# EAGLE design pcb (EAGLE 7.7.0)
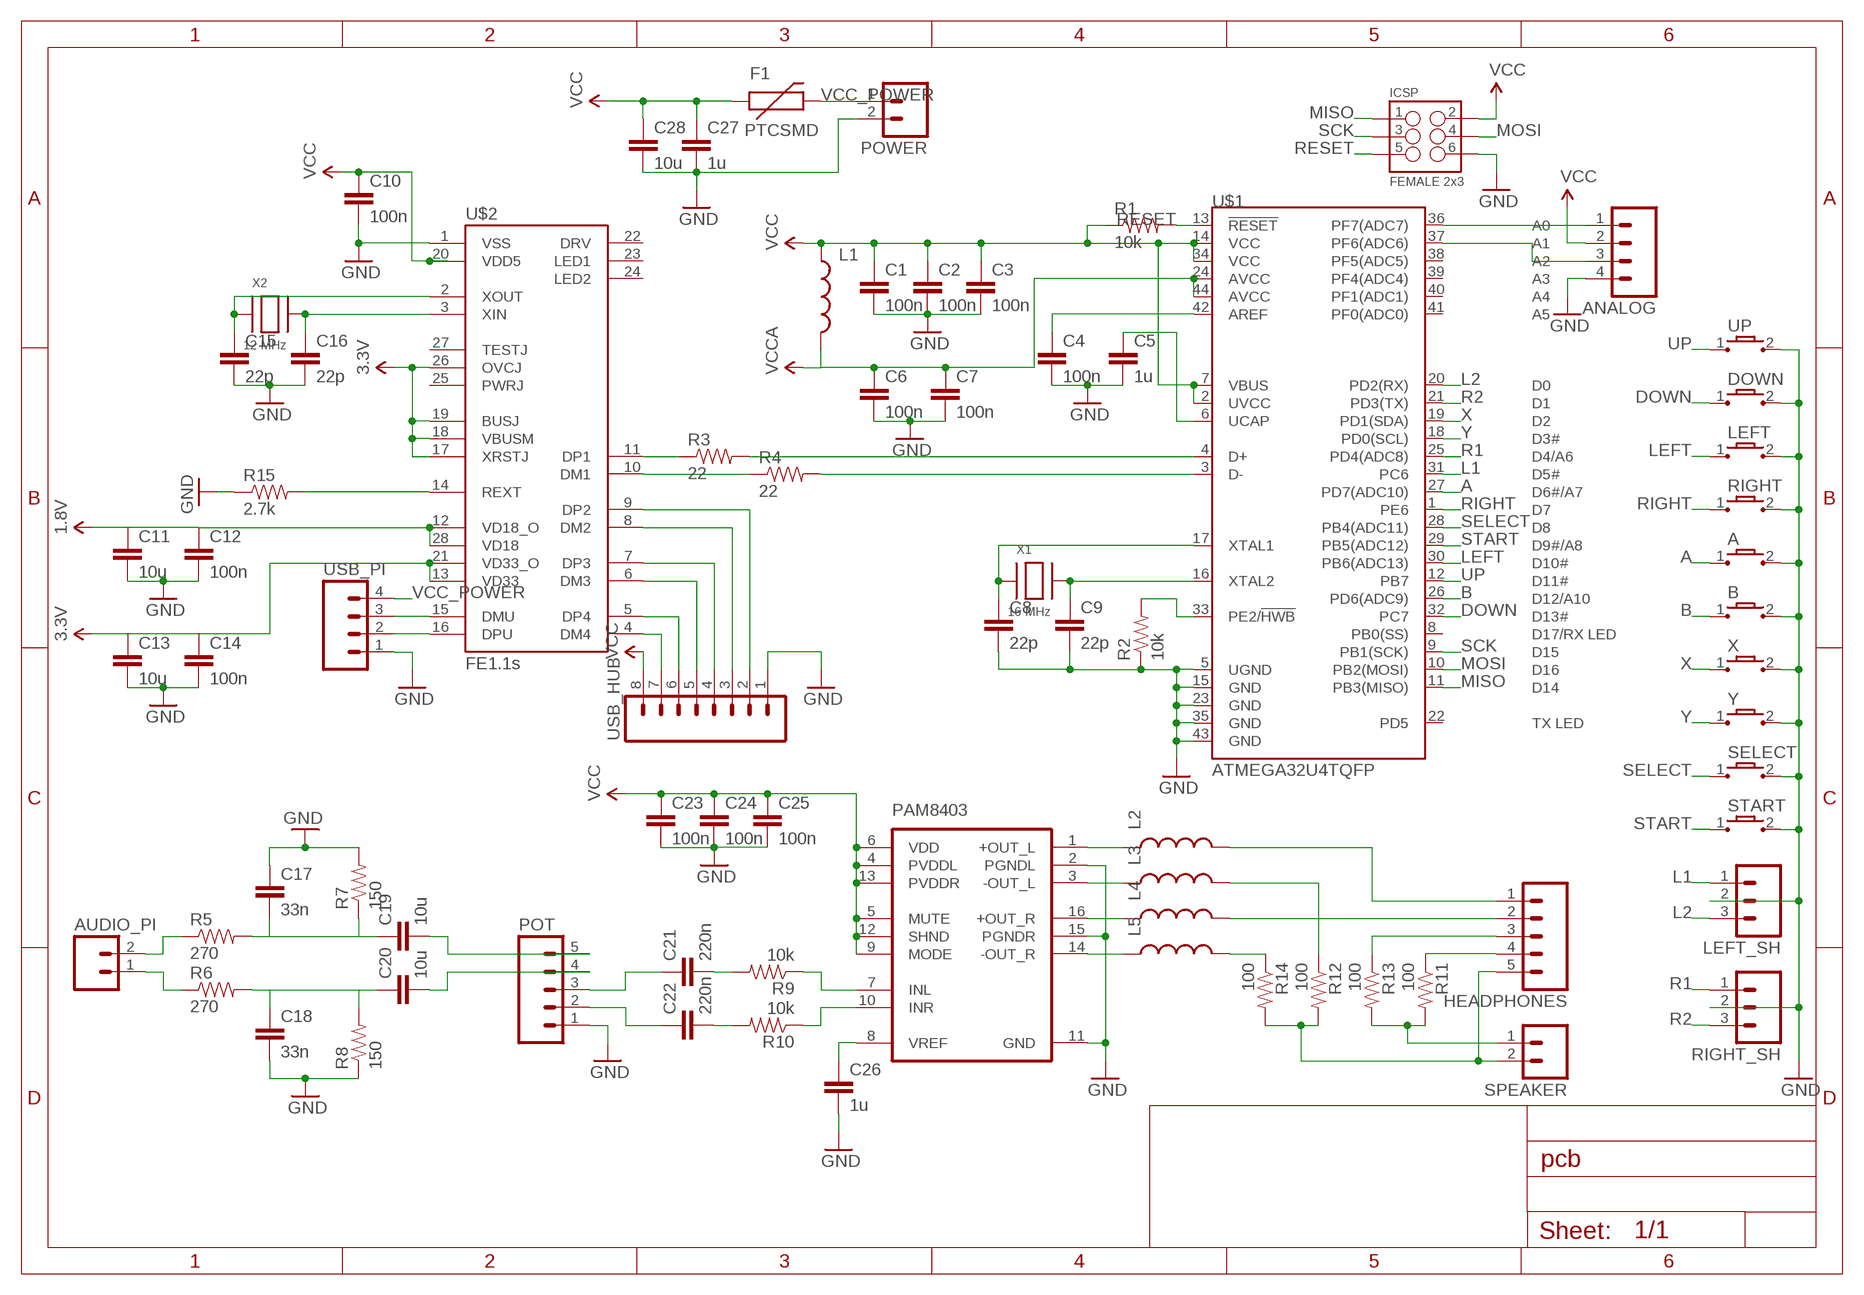
[diagram p0: schematic, sheet 1]

## Parts
A  DMG_CONDUCTIVE  [CIRCLE_BUTTON2]
ANALOG  M04PTH  [1X04]
AUDIO_PI  M02PTH  [1X02]
B  DMG_CONDUCTIVE  [CIRCLE_BUTTON2]
C1  100n  CAP0805  [0805]
C2  100n  CAP0805  [0805]
C3  100n  CAP0805  [0805]
C4  100n  CAP0805  [0805]
C5  1u  CAP0805  [0805]
C6  100n  CAP0805  [0805]
C7  100n  CAP0805  [0805]
C8  22p  CAP0805  [0805]
C9  22p  CAP0805  [0805]
C10  100n  CAP0805  [0805]
C11  10u  CAP0805  [0805]
C12  100n  CAP0805  [0805]
C13  10u  CAP0805  [0805]
C14  100n  CAP0805  [0805]
C15  22p  CAP0805  [0805]
C16  22p  CAP0805  [0805]
C17  33n  CAP0805  [0805]
C18  33n  CAP0805  [0805]
C19  10u  CAP0805  [0805]
C20  10u  CAP0805  [0805]
C21  220n  CAP0805  [0805]
C22  220n  CAP0805  [0805]
C23  100n  CAP0805  [0805]
C24  100n  CAP0805  [0805]
C25  100n  CAP0805  [0805]
C26  1u  CAP0805  [0805]
C27  1u  CAP0805  [0805]
C28  10u  CAP0805  [0805]
DOWN  DMG_CONDUCTIVE  [CIRCLE_BUTTON2]
F1  PTCSMD  [PTC-1206]
HEADPHONES  M05PTH  [1X05]
ICSP  FEMALE 2x3  M03X2FEMALE  [2X3]
L1  INDUCTOR0805  [0805]
L2  INDUCTOR0805  [0805]
L3  INDUCTOR0805  [0805]
L4  INDUCTOR0805  [0805]
L5  INDUCTOR0805  [0805]
LEFT  DMG_CONDUCTIVE  [CIRCLE_BUTTON2]
LEFT_SH  M03PTH  [1X03]
PAM8403  PAM8403  [SOP-16]
POT  M05PTH  [1X05]
POWER  M02PTH  [1X02]
R1  10k  RESISTOR0805-RES  [0805]
R2  10k  RESISTOR0805-RES  [0805]
R3  22  RESISTOR0805-RES  [0805]
R4  22  RESISTOR0805-RES  [0805]
R5  270  RESISTOR0805-RES  [0805]
R6  270  RESISTOR0805-RES  [0805]
R7  150  RESISTOR0805-RES  [0805]
R8  150  RESISTOR0805-RES  [0805]
R9  10k  RESISTOR0805-RES  [0805]
R10  10k  RESISTOR0805-RES  [0805]
R11  100  RESISTOR0805-RES  [0805]
R12  100  RESISTOR0805-RES  [0805]
R13  100  RESISTOR0805-RES  [0805]
R14  100  RESISTOR0805-RES  [0805]
R15  2.7k  RESISTOR0805-RES  [0805]
RIGHT  DMG_CONDUCTIVE  [CIRCLE_BUTTON2]
RIGHT_SH  M03PTH  [1X03]
SELECT  DMG_CONDUCTIVE2  [START_STOP2]
SPEAKER  M02PTH  [1X02]
START  DMG_CONDUCTIVE2  [START_STOP2]
U$1  ATMEGA32U4TQFP  [SPARKFUN-DIGITALIC_TQFP44]
U$2  FE1.1S  [FE1.1S_SSOP-28]
UP  DMG_CONDUCTIVE  [CIRCLE_BUTTON2]
USB_HUB  M08  [1X08_ROUND]
USB_PI  M04PTH  [1X04]
X  DMG_CONDUCTIVE  [CIRCLE_BUTTON2]
X1  16 MHz  XTALNX5032  [NX5032]
X2  12 MHz  XTALNX5032  [NX5032]
Y  DMG_CONDUCTIVE  [CIRCLE_BUTTON2]

## Nets
1.8V: C11.1 C12.1 U$2.12(VD18_O) U$2.28(VD18)
3.3V: C13.1 C14.1 U$2.13(VD33) U$2.17(XRSTJ) U$2.18(VBUSM) U$2.19(BUSJ) U$2.21(VD33_O) U$2.26(OVCJ)
A: A.1 U$1.27(PD7(ADC10))
AUDIO_GND: HEADPHONES.5 R12.2 R14.2 SPEAKER.2
AUDIO_L2MONO: HEADPHONES.4 R11.1
AUDIO_MONO: R11.2 R13.2 SPEAKER.1
AUDIO_R2MONO: HEADPHONES.3 R13.1
AUDIO_STEREO_L: HEADPHONES.1 L2.2
AUDIO_STEREO_R: HEADPHONES.2 L4.2
B: B.1 U$1.26(PD6(ADC9))
DOWN: DOWN.1 U$1.32(PC7)
GND: A.2 ANALOG.4 B.2 C1.2 C2.2 C3.2 C4.2 C5.2 C6.2 C7.2 C8.2 C9.2 C10.2 C11.2 C12.2 C13.2 C14.2 C15.2 C16.2 C17.1 C18.2 C23.2 C24.2 C25.2 C26.2 C27.2 C28.2 DOWN.2 ICSP.6 LEFT.2 LEFT_SH.2 PAM8403.2(PGNDL) PAM8403.11(GND) PAM8403.15(PGNDR) POT.1 POWER.2 R2.1 R7.2 R8.1 R15.1 RIGHT.2 RIGHT_SH.2 SELECT.2 START.2 U$1.5(UGND) U$1.15(GND) U$1.23(GND) U$1.35(GND) U$1.43(GND) U$2.1(VSS) UP.2 USB_HUB.1 USB_PI.1 X.2 Y.2
L1: LEFT_SH.1 U$1.31(PC6)
L2: LEFT_SH.3 U$1.20(PD2(RX))
LEFT: LEFT.1 U$1.30(PB6(ADC13))
MISO: ICSP.1 U$1.11(PB3(MISO))
MOSI: ICSP.4 U$1.10(PB2(MOSI))
N$2: C4.1 U$1.42(AREF)
N$3: C5.1 U$1.6(UCAP)
N$4: R2.2 U$1.33(PE2/!HWB)
N$5: R3.1 U$2.11(DP1)
N$6: R4.1 U$2.10(DM1)
N$7: C8.1 U$1.17(XTAL1) X1.P$1
N$8: C9.1 U$1.16(XTAL2) X1.P$2
N$9: R3.2 U$1.4(D+)
N$10: R4.2 U$1.3(D-)
N$11: C15.1 U$2.2(XOUT) X2.P$1
N$12: C16.1 U$2.3(XIN) X2.P$2
N$13: AUDIO_PI.2 R5.1
N$14: AUDIO_PI.1 R6.1
N$15: C17.2 C19.1 R5.2 R7.1
N$16: C18.1 C20.1 R6.2 R8.2
N$17: C26.1 PAM8403.8(VREF)
N$18: L2.1 PAM8403.1(+OUT_L)
N$19: C19.2 POT.5
N$20: C20.2 POT.4
N$21: C21.1 POT.3
N$22: C22.1 POT.2
N$23: C21.2 R9.2
N$24: C22.2 R10.2
N$25: PAM8403.7(INL) R9.1
N$26: PAM8403.10(INR) R10.1
N$28: L3.1 PAM8403.3(-OUT_L)
N$29: L3.2 R12.1
N$30: L4.1 PAM8403.16(+OUT_R)
N$32: L5.1 PAM8403.14(-OUT_R)
N$33: L5.2 R14.1
N$34: U$2.4(DM4) USB_HUB.7
N$35: U$2.5(DP4) USB_HUB.6
N$36: U$2.6(DM3) USB_HUB.5
N$37: R15.2 U$2.14(REXT)
N$39: U$2.7(DP3) USB_HUB.4
N$40: U$2.8(DM2) USB_HUB.3
N$41: ANALOG.1 U$1.36(PF7(ADC7))
N$42: ANALOG.3 U$1.37(PF6(ADC6))
N$43: U$2.9(DP2) USB_HUB.2
N$45: U$2.15(DMU) USB_PI.3
N$46: U$2.16(DPU) USB_PI.2
R1: RIGHT_SH.1 U$1.25(PD4(ADC8))
R2: RIGHT_SH.3 U$1.21(PD3(TX))
RESET: ICSP.5 R1.2 U$1.13(!RESET)
RIGHT: RIGHT.1 U$1.1(PE6)
SCK: ICSP.3 U$1.9(PB1(SCK))
SELECT: SELECT.1 U$1.28(PB4(ADC11))
START: START.1 U$1.29(PB5(ADC12))
UP: U$1.12(PB7) UP.1
VCC: ANALOG.2 C1.1 C2.1 C3.1 C10.1 C23.1 C24.1 C25.1 C27.1 C28.1 F1.1 ICSP.2 L1.1 PAM8403.4(PVDDL) PAM8403.5(MUTE) PAM8403.6(VDD) PAM8403.9(MODE) PAM8403.12(SHND) PAM8403.13(PVDDR) R1.1 U$1.2(UVCC) U$1.7(VBUS) U$1.14(VCC) U$1.34(VCC) U$2.20(VDD5) USB_HUB.8
VCC_POWER: F1.2 POWER.1 USB_PI.4
VCCA: C6.1 C7.1 L1.2 U$1.24(AVCC) U$1.44(AVCC)
X: U$1.19(PD1(SDA)) X.1
Y: U$1.18(PD0(SCL)) Y.1
Unconnected: U$1.8(PB0(SS)) U$1.22(PD5) U$1.38(PF5(ADC5)) U$1.39(PF4(ADC4)) U$1.40(PF1(ADC1)) U$1.41(PF0(ADC0)) U$2.22(DRV) U$2.23(LED1) U$2.24(LED2) U$2.25(PWRJ) U$2.27(TESTJ)

## Library data of the parts
A B DOWN LEFT RIGHT SELECT START UP X Y = dmg-conductive:DMG_CONDUCTIVE
ANALOG USB_PI = SparkFun-Connectors:M04: Header 4 Standard 4-pin 0.1" header. Use with straight break away headers (SKU : PRT-00116), right angle break away headers (PRT-00553), swiss pins (PRT-00743), machine pins (PRT-00117), and female headers (PRT-00115). Molex polarized connector foot print use with SKU : PRT-08231 with associated crimp pins and housings. 1MM SMD Version SKU: PRT-10208; PROD_ID: CONN-09696
AUDIO_PI POWER SPEAKER = SparkFun-Connectors:M02: Standard 2-pin 0.1" header. Use with - straight break away headers ( PRT-00116) - right angle break away headers (PRT-00553) - swiss pins (PRT-00743) - machine pins (PRT-00117) - female headers (PRT-00115) Molex polarized connector foot print use with: PRT-08233 with associated crimp pins and housings. 2.54_SCREWTERM for use with PRT-10571. 3.5mm Screw Terminal footprints for PRT-08084 5mm Screw Terminal footprints for use with PRT-08432
C1-C28 = SparkFun-Passives:CAP: Capacitor Standard 0603 ceramic capacitor, and 0.1" leaded capacitor.
F1 = SparkFun-PowerIC:PTC: Resettable Fuse PTC Resettable Fuse. Spark Fun Electronics SKU : COM-08357; PROD_ID: RES-11150
HEADPHONES POT = SparkFun-Connectors:M05: Header 5 Standard 5-pin 0.1" header. Use with straight break away headers (SKU : PRT-00116), right angle break away headers (PRT-00553), swiss pins (PRT-00743), machine pins (PRT-00117), and female headers (PRT-00115). Molex polarized connector foot print use with SKU : PRT-08230 with associated crimp pins and housings.
ICSP = SparkFun-Connectors:M03X2: 2x3 .1" header. Shrouded, with keying- CONN-10681 SMT- CONN-11415 Pogo pins- HW-11044; PROD_ID: CONN-11566
L1-L5 = SparkFun-Passives:INDUCTOR: Inductors Basic Inductor/Choke - 0603 and 1206. Footprints are not proven and vary greatly between part numbers. INDUCTOR POWER 3.3UH 4.0A SMD 0.197" L x 0.197" W x 0.177" H (5.00mm x 5.00mm x 4.50mm)
LEFT_SH RIGHT_SH = SparkFun-Connectors:M03: Header 3 Standard 3-pin 0.1" header. Use with straight break away headers (SKU : PRT-00116), right angle break away headers (PRT-00553), swiss pins (PRT-00743), machine pins (PRT-00117), and female headers (PRT-00115). Molex polarized connector foot print use with SKU : PRT-08232 with associated crimp pins and housings.
PAM8403 = PAM8403:PAM8403: Dual channel audio amplifier IC - PAM8403
R1-R15 = SparkFun-Passives:RESISTOR: Resistor Basic schematic elements and footprints for 0603, 1206, and PTH resistors.
U$1 = SparkFun-Retired:ATMEGA32U4: Atmel 44-pin 8-bit Microcontroller with 32KBytes of ISP Flash and USB Controller ----- Please use the QFN-44-NOPAD_1:1 package for the footprint of all boards using a 32U4. Route traces directly away from the pads as much as possible.; PROD_ID: IC-11161
U$2 = imcom:FE1.1S: A USB 2.0 hub IC. http://www.jfd-ic.com/Documents/FE1.1s%20Data%20Sheet%20%28Rev.%201.0%29.pdf
USB_HUB = SparkFun-Connectors:M08: Header 8 Standard 8-pin 0.1" header. Use with straight break away headers (SKU : PRT-00116), right angle break away headers (PRT-00553), swiss pins (PRT-00743), machine pins (PRT-00117), and female headers (PRT-00115).; PROD_ID: CONN-08437
X1 X2 = adafruit:XTAL: Low cost SMT crystals, no capacitors included http://www.ladyada.net/library/eagle

## Board
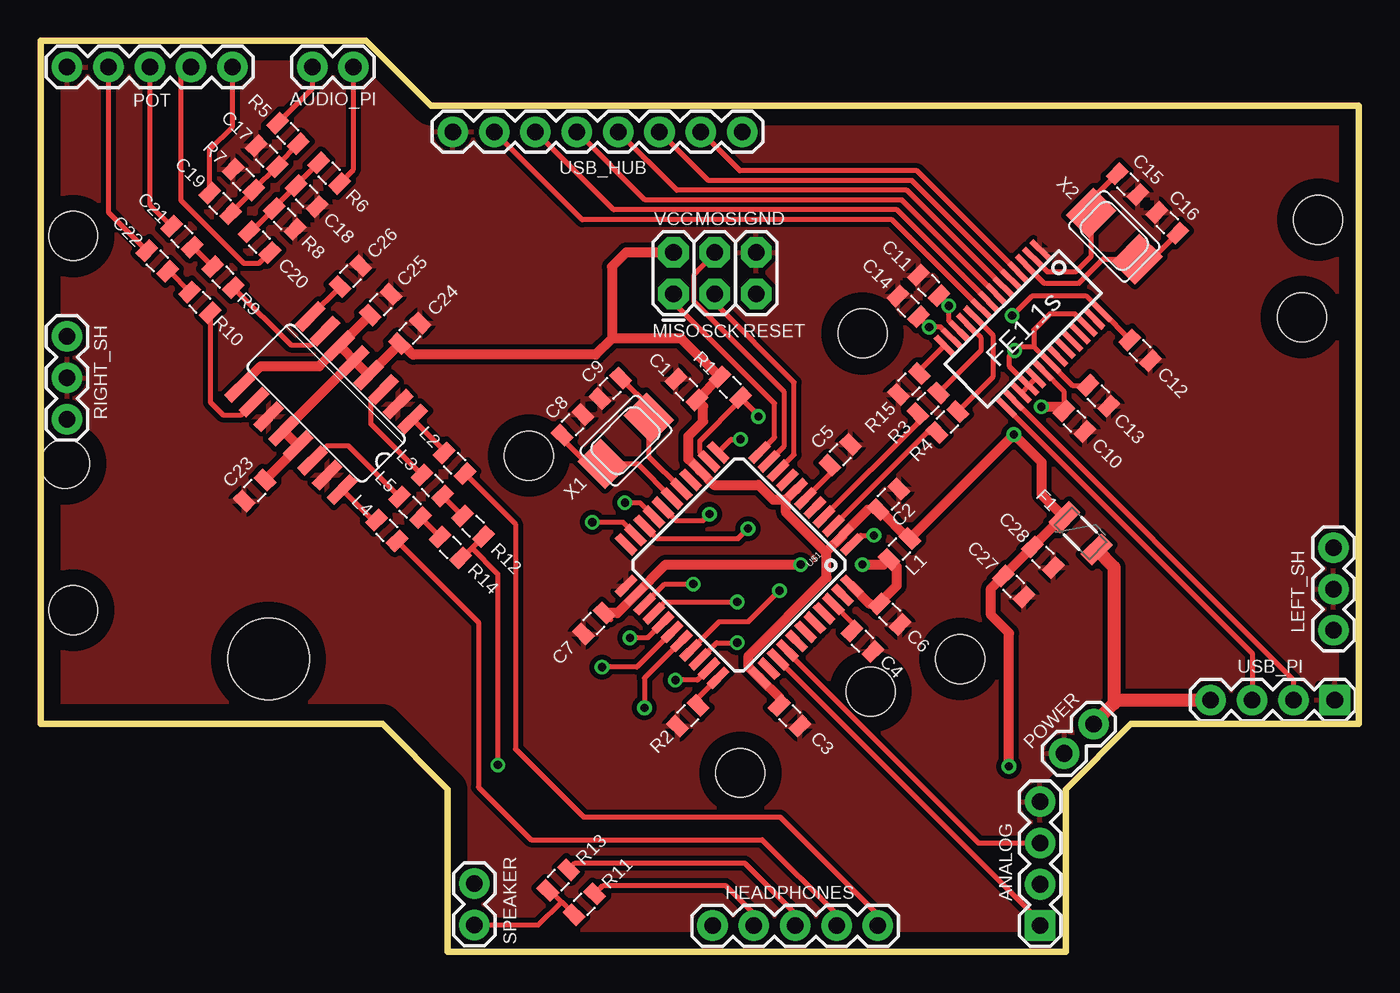
[diagram p1: board, top side]
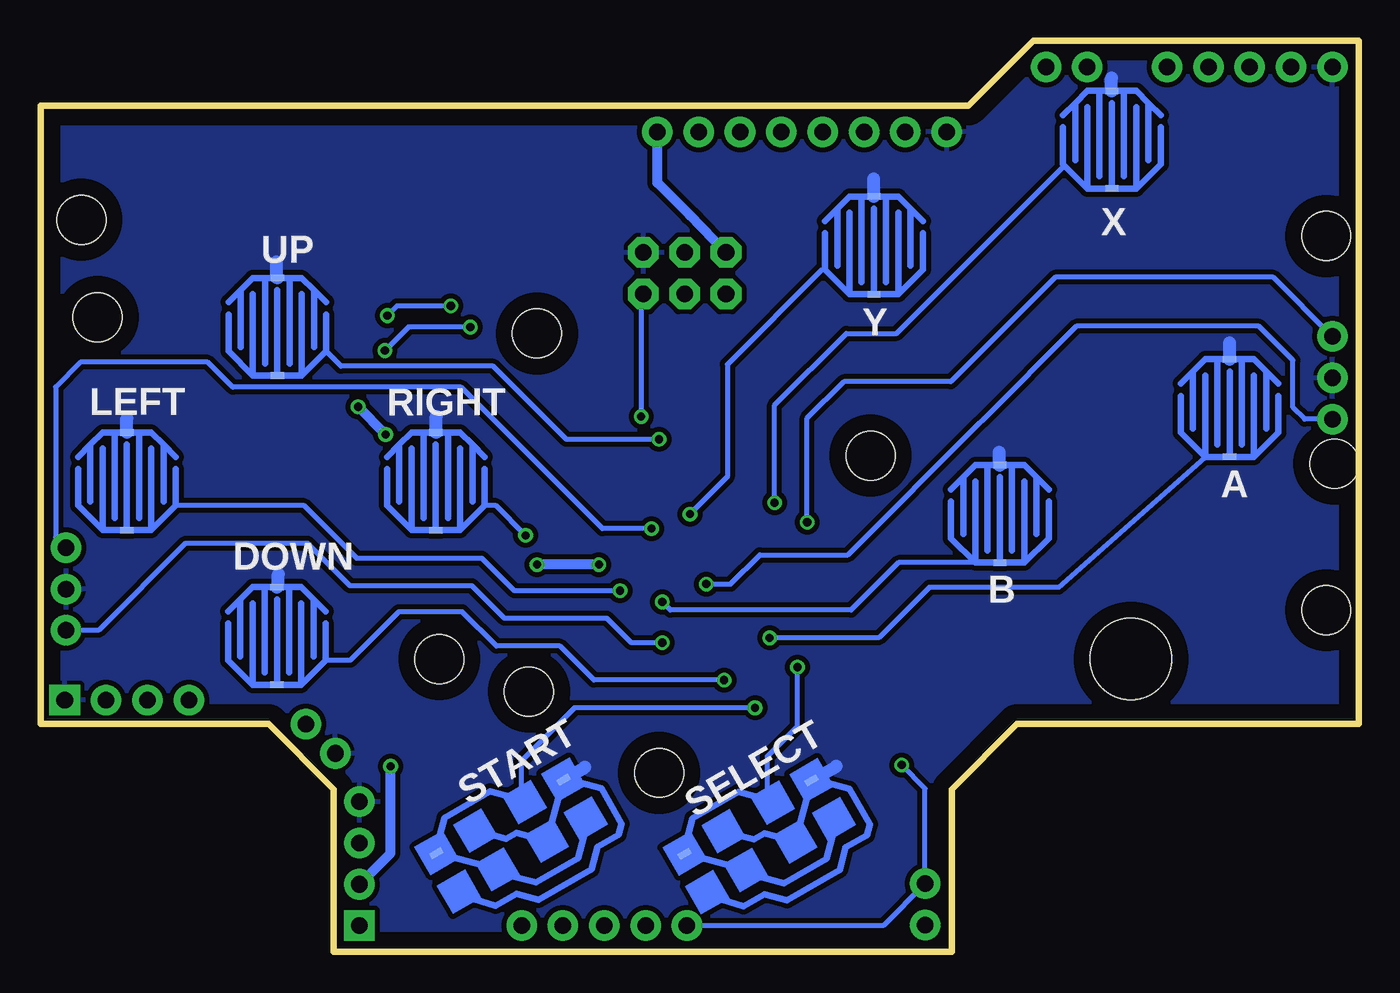
[diagram p2: board, bottom side, seen from below]

Size 81 x 56 mm. Coordinates in mm from the lower left corner, seen from the top.
Outline: 0,56 20,56 24,52 81,52 81,14 67,14 63,10 63,0 25,0 25,10 21,14 0,14 0,56
Copper layers (1*16): Top 0.035mm / dielectric 1.5mm / Bottom 0.035mm
Design rules "default": minimum track width 10mil, minimum drill 24mil, track to track 8mil, track to pad 8mil, pad to pad 8mil, via to via 8mil, smd to smd 8mil, copper to edge 40mil, drill to drill 8mil, minimum pad ring 10mil, minimum via ring 8mil, stop-mask expansion 4mil, vias tented up to drill 0mil, thermal gap 10mil
Holes 3 mm at 78.5,45 77.5,39 50.5,38 30,30.5 43,11 56.5,18 51,16 2,44 1.5,30 2,21
Holes 5 mm at 14,18

### Footprints (pad centres in the part's own frame; a part is rotated, then mirrored left to right if it is on the bottom)
CIRCLE_BUTTON2 = smd 0.813 x 0.406: 1 0,-3; 2 0,3
1X04 = drill 1.016 pad 1.88 square: 1 0,0 | drill 1.016 pad 1.88: 2 2.54,0; 3 5.08,0; 4 7.62,0
1X02 = drill 1.016 pad 1.88: 1 0,0; 2 2.54,0
0805 = smd 0.8 x 1.2: 1 -0.9,0; 2 0.9,0
PTC-1206 = smd 1 x 1.8: 1 -1.4,0; 2 1.4,0
1X05 = drill 1.016 pad 1.88: 1 0,0; 2 2.54,0; 3 5.08,0; 4 7.62,0; 5 10.16,0
2X3 = drill 1.016 pad 1.88 octagon: 1 0,0; 2 0,2.54; 3 2.54,0; 4 2.54,2.54; 5 5.08,0; 6 5.08,2.54
1X03 = drill 1.016 pad 1.88: 1 0,0; 2 2.54,0; 3 5.08,0
SOP-16 = smd 0.66 x 2.032: 1 -4.445,-3.073; 2 -3.175,-3.073; 3 -1.905,-3.073; 4 -0.635,-3.073; 5 0.635,-3.073; 6 1.905,-3.073; 7 3.175,-3.073; 8 4.445,-3.073; 9 4.445,3.073; 10 3.175,3.073; 11 1.905,3.073; 12 0.635,3.073; 13 -0.635,3.073; 14 -1.905,3.073; 15 -3.175,3.073; 16 -4.445,3.073
START_STOP2 = smd 0.813 x 0.406: 1 -4.518,1.365; 2 4.5,1.375
SPARKFUN-DIGITALIC_TQFP44 = smd 1.5 x 0.5: 1 -5.8,4; 2 -5.8,3.2; 3 -5.8,2.4; 4 -5.8,1.6; 5 -5.8,0.8; 6 -5.8,0; 7 -5.8,-0.8; 8 -5.8,-1.6; 9 -5.8,-2.4; 10 -5.8,-3.2; 11 -5.8,-4; 23 5.8,-4; 24 5.8,-3.2; 25 5.8,-2.4; 26 5.8,-1.6; 27 5.8,-0.8; 28 5.8,0; 29 5.8,0.8; 30 5.8,1.6; 31 5.8,2.4; 32 5.8,3.2; 33 5.8,4 | smd 0.5 x 1.5: 12 -4,-5.8; 13 -3.2,-5.8; 14 -2.4,-5.8; 15 -1.6,-5.8; 16 -0.8,-5.8; 17 0,-5.8; 18 0.8,-5.8; 19 1.6,-5.8; 20 2.4,-5.8; 21 3.2,-5.8; 22 4,-5.8; 34 4,5.8; 35 3.2,5.8; 36 2.4,5.8; 37 1.6,5.8; 38 0.8,5.8; 39 0,5.8; 40 -0.8,5.8; 41 -1.6,5.8; 42 -2.4,5.8; 43 -3.2,5.8; 44 -4,5.8
FE1.1S_SSOP-28 = smd 0.35 x 1.5: 1 -4.16,-2.7; 2 -3.52,-2.7; 3 -2.88,-2.7; 4 -2.24,-2.7; 5 -1.6,-2.7; 6 -0.96,-2.7; 7 -0.32,-2.7; 8 0.32,-2.7; 9 0.96,-2.7; 10 1.6,-2.7; 11 2.24,-2.7; 12 2.88,-2.7; 13 3.52,-2.7; 14 4.16,-2.7; 15 4.16,2.7; 16 3.52,2.7; 17 2.88,2.7; 18 2.24,2.7; 19 1.6,2.7; 20 0.96,2.7; 21 0.32,2.7; 22 -0.3,2.7; 23 -0.96,2.7; 24 -1.6,2.7; 25 -2.24,2.7; 26 -2.88,2.7; 27 -3.52,2.7; 28 -4.16,2.7
1X08_ROUND = drill 1.016 pad 1.88: 1 0,0; 2 2.54,0; 3 5.08,0; 4 7.62,0; 5 10.16,0; 6 12.7,0; 7 15.24,0; 8 17.78,0
NX5032 = smd 2 x 2.4: P$1 2,0; P$2 -2,0

### Placement (x,y rotation side)
A  7.94,33.42 0 bottom
ANALOG  61.41,1.61 90 top
AUDIO_PI  19.22,54.39 180 top
B  22.06,26.92 0 bottom
C1  39.68,34.56 135 top
C2  52.1,27.81 45 top
C3  46.02,14.51 315 top
C4  50.5,19.09 315 top
C5  49.13,30.55 45 top
C6  52.17,20.76 315 top
C7  33.99,20.19 225 top
C8  32.68,32.39 45 top
C9  35,34.63 225 top
C10  63.52,32.61 315 top
C11  54.57,40.96 135 top
C12  67.56,36.97 315 top
C13  65,34.18 315 top
C14  53.31,39.67 135 top
C15  66.79,47.18 315 top
C16  69.23,44.81 135 top
C17  13.89,48.91 315 top
C18  16.34,46.45 315 top
C19  11.03,46 135 top
C20  13.45,43.62 315 top
C21  8.67,43.96 315 top
C22  7.16,42.46 315 top
C23  13.14,28.36 225 top
C24  22.68,38.01 45 top
C25  20.89,39.78 45 top
C26  19.03,41.53 45 top
C27  59.79,22.45 315 top
C28  61.58,24.26 315 top
DOWN  66.48,19.42 0 bottom
F1  63.9,25.72 315 top
HEADPHONES  51.45,1.61 180 top
ICSP  38.89,40.44 0 top
L1  52.77,24.76 225 top
L2  25.43,30.03 315 top
L3  24.06,28.67 315 top
L4  21.27,25.9 315 top
L5  22.7,27.32 315 top
LEFT  75.7,28.92 0 bottom
LEFT_SH  79.44,19.76 90 top
PAM8403  17.54,33.73 135 top
POT  1.62,54.38 0 top
POWER  64.7,14 225 top
R1  42.37,34.69 315 top
R2  39.77,14.51 45 top
R3  54.54,33.72 225 top
R4  55.72,32.56 225 top
R5  15.19,50.3 315 top
R6  17.73,47.86 135 top
R7  12.46,47.45 135 top
R8  14.99,45.05 135 top
R9  11.21,41.47 135 top
R10  9.78,39.93 135 top
R11  33.41,2.92 225 top
R12  26.57,26.17 315 top
R13  31.8,4.41 225 top
R14  25.17,24.85 315 top
R15  53.36,34.9 45 top
RIGHT  56.72,28.92 0 bottom
RIGHT_SH  1.62,32.74 90 top
SELECT  36.84,7.1 30 bottom
SPEAKER  26.65,1.65 90 top
START  52.09,7.14 30 bottom
U$1  42.91,23.77 225 top
U$2  60.38,38.3 225 top
UP  66.46,38.42 0 bottom
USB_HUB  25.33,50.4 0 top
USB_PI  79.52,15.47 180 top
X  15.18,49.92 0 bottom
X1  35.95,31.42 225 top
X2  65.97,43.99 135 top
Y  29.8,43.42 0 bottom

### Tracks (layer width: path | path; a pad name or v marks a point on that pad's centre or on a via)
1.8V  (via drill 0.5)
  Top 0.305: C12.1 66.92,37.64 U$2.28 64.26,40.3 60.9,40.3 v59.7,39.1 | C11.1 55.8,39.73 v55.8,39.7 55.8,38.81 U$2.12
  Bottom 0.305: v55.8,39.7 59.1,39.7 v59.7,39.1
3.3V  (via drill 0.5)
  Top 0.305: C13.1 63.41,34.82 U$2.21 61.03,37.2 | U$2.19 U$2.18 | U$2.18 U$2.17 | U$2.18 | C14.1 54.58,38.4 v54.6,38.4 55.3,38.4 U$2.13 | 61.03,37.2 60.1,37.2 v59.85,36.95 59.5,36.6 59.5,36.01 U$2.18 | U$2.26 63.55,39.2 62,39.2 61.03,38.23 61.03,37.2
  Bottom 0.305: v54.6,38.4 58.4,38.4 v59.85,36.95
A  (via drill 0.5)
  Top 0.305: U$1.27 37.3,19.3 v36.2,19.3
  Bottom 0.305: 9.44,30.42 18.46,22.4 26.4,22.4 29.5,19.3 v36.2,19.3
AUDIO_GND  (via drill 0.5)
  Top 0.305: R12.2 26.5,24.83 | 26.5,24.83 25.88,24.21 R14.2 | v28.09,11.48 28.09,23.24 26.5,24.83
  Bottom 0.305: v28.09,11.48 26.65,10.04 SPEAKER.2 29.23,1.62 32.92,1.62 32.94,1.61 HEADPHONES.5
AUDIO_L2MONO
  Top 0.305: R11.1 34.56,4.08 42.09,4.08 43.81,2.36 43.81,1.62 HEADPHONES.4
AUDIO_MONO
  Top 0.305: R13.2 31.28,3.78 31.99,3.06 | 31.99,3.06 R11.2 | SPEAKER.1 30.58,1.65 31.99,3.06
AUDIO_R2MONO
  Top 0.305: R13.1 32.85,5.47 43.26,5.47 46.36,2.37 46.36,1.61 HEADPHONES.3
AUDIO_STEREO_L
  Top 0.305: L2.2 29.17,26.29 29.17,12.46 33.35,8.29 45.44,8.29 51.43,2.29 51.43,1.62 HEADPHONES.1
AUDIO_STEREO_R
  Top 0.305: 21.8,25.16 L4.2 26.91,20.26 26.91,10.11 30.12,6.9 44.34,6.9 48.91,2.33 HEADPHONES.2
B  (via drill 0.5)
  Top 0.305: U$1.26 38.37,21.5 v42.8,21.5
  Bottom 0.305: 23.56,23.92 28.28,23.92 31.2,21 42.3,21 v42.8,21.5
DOWN  (via drill 0.5)
  Top 0.305: U$1.32 40.36,16.7 v39,16.7
  Bottom 0.305: 63.48,17.92 61.98,17.92 59,20.9 55.1,20.9 53,18.8 49.1,18.8 47,16.7 v39,16.7
GND
  Bottom 0.61: 7.94,37.42 7.9,37.46
  Bottom 0.813: Y.2 29.8,47.5 | X.2 15.2,52.94 15.2,53.7 | B.2 22.1,29.96 22.1,30.7 | UP.2 66.5,41.46 66.5,42.4 | RIGHT.2 56.7,31.94 56.7,32.9 | DOWN.2 66.4,22.5 66.4,23.2 | LEFT.2 75.7,32.8 | A.2 7.94,37.42 | START.2 47.56,11.34 | SELECT.2 32.1,11.4
  pour Top (isolate 0.305): 0,56 81.1,56 81.1,0 0,0
  pour Bottom (isolate 0.305): 0.1,56 0.1,-0.1 81.2,-0.1 81.2,56
L1  (via drill 0.5)
  Top 0.305: U$1.31 41.53,19 v42.8,19
  Bottom 0.305: v42.8,19 44.7,19 46.2,20.5 52.5,20.5 54.5,22.5 62,22.5 64.62,25.12 72.08,25.12 77.44,19.76 LEFT_SH.1
L2  (via drill 0.5)
  Top 0.305: U$1.20 37.89,25.4 42.85,25.4 v43.46,26.01
  Bottom 0.305: v43.46,26.01 46.48,26.01 55.17,34.7 69.2,34.7 70.74,36.24 78.56,36.24 80.08,34.73 80.08,25.48 LEFT_SH.3
LEFT  (via drill 0.5)
  Top 0.305: U$1.30 41.7,20.3 43.5,20.3 v45.4,22.2
  Bottom 0.305: v45.4,22.2 51.9,22.2 53.9,24.2 61.6,24.2 64.82,27.42 72.7,27.42
MISO
  Top 0.305: U$1.11 45.1,31.62 45.1,33.7 38.89,39.91 ICSP.1
MOSI
  Top 0.305: U$1.10 45.7,31.09 45.7,34.4 40.15,39.95 40.15,41.6 ICSP.4
N$2
  Top 0.305: 50.15,19.93 C4.1 49.86,20.21 U$1.42
N$3
  Top 0.305: U$1.6 48.49,29.36 C5.1
N$4
  Top 0.305: 40.14,15.35 R2.2 40.41,15.61 U$1.33
N$5
  Top 0.305: R3.1 57.8,36.98 57.8,37.71 U$2.11
N$6
  Top 0.305: U$2.10 58.5,37.92 58.5,35.33 R4.1
N$7
  Top 0.305: U$1.17 36.68,30 X1.P$1 33.79,29.8 32.05,31.55 C8.1
N$8
  Top 0.305: U$1.16 37.36,30.45 X1.P$2 37.46,33.44 C9.1
N$9
  Top 0.305: U$1.4 53.9,32.5 R3.2
N$10
  Top 0.305: U$1.3 54.45,31.92 R4.2
N$11
  Top 0.305: U$2.2 61.86,41.8 63.6,41.8 64.56,42.76 X2.P$1 64.56,46.22 C15.1
N$12
  Top 0.305: U$2.3 61.65,41.1 63.8,41.1 65.28,42.58 X2.P$2 68.27,42.58 C16.1
N$13
  Top 0.305: AUDIO_PI.2 16.68,53.06 R5.1
N$14
  Top 0.305: R6.1 19.22,48.08 AUDIO_PI.1
N$15
  Top 0.305: R5.2 14.53,48.36 C17.2 13.1,46.84 R7.1 11.67,45.39 C19.1
N$16
  Top 0.305: R6.2 15.7,47.1 C18.1 14.35,45.73 R8.2 12.93,44.26 C20.1
N$17
  Top 0.305: 16.74,39.04 PAM8403.8 18.39,40.87
  Top 0.61: C26.1 18.39,40.87
N$18
  Top 0.305: PAM8403.1 24.8,30.82 L2.1
N$19
  Top 0.305: C19.2 10.4,49.33 11.78,50.72 POT.5
N$20
  Top 0.305: C20.2 13.4,42.3 12.5,42.3 8.62,46.18 8.62,53.76 POT.4
N$21
  Top 0.305: C21.1 6.7,45.93 POT.3
N$22
  Top 0.305: C22.1 4.16,45.46 POT.2
N$23
  Top 0.305: C21.2 9.36,43.32 R9.2
N$24
  Top 0.305: C22.2 7.88,41.82 R10.2
N$25
  Top 0.305: R9.1 15.38,37.3 16.62,37.3 PAM8403.7
N$26
  Top 0.305: 13.4,33.9 PAM8403.10 12.32,33 11.2,33 10.42,33.78 R10.1
N$28
  Top 0.305: L3.1 20.3,32.43 20.3,33.9 20.95,34.55 PAM8403.3
N$29
  Top 0.305: L3.2 R12.1
N$30
  Top 0.305: PAM8403.16 20.38,26.54 L4.1
N$32
  Top 0.305: L5.1 18.92,31.1 17.6,31.1 PAM8403.14
N$33
  Top 0.305: L5.2 R14.1
N$34
  Top 0.305: U$2.4 53.85,48 42.97,48 USB_HUB.7
N$35
  Top 0.305: U$2.5 53.54,47.4 41.03,47.4 USB_HUB.6
N$36
  Top 0.305: U$2.6 53.24,46.8 39.09,46.8 USB_HUB.5
N$37
  Top 0.305: U$2.14 53.99,35.73 R15.2
N$39
  Top 0.305: U$2.7 52.93,46.2 37.15,46.2 USB_HUB.4
N$40
  Top 0.305: U$2.8 52.63,45.6 35.21,45.6 USB_HUB.3
N$41
  Top 0.305: U$1.36 61.41,1.88 ANALOG.1
N$42
  Top 0.305: U$1.37 46.22,18.2 46.22,18.08 57.61,6.69 ANALOG.3
N$43
  Top 0.305: U$2.9 52.32,45 33.27,45 USB_HUB.2
N$45
  Top 0.305: U$2.15 74.44,18.36 USB_PI.3
N$46
  Top 0.305: U$2.16 76.98,16.72 USB_PI.2
R1  (via drill 0.5)
  Top 0.305: U$1.25 38.34,22.6 v40.1,22.6
  Bottom 0.305: v40.1,22.6 38.6,22.6 36.8,24.4 31.4,24.4 23.28,32.52 23.2,32.6 17.35,38.45 6.14,38.45 4.05,36.36 4.05,33.45 3.33,32.74 RIGHT_SH.1
R2  (via drill 0.5)
  Top 0.305: U$1.21 36.54,25.66 35.8,26.4 v33.9,26.4
  Bottom 0.305: v33.9,26.4 33.9,32.8 31.65,35.05 25.07,35.05 18.65,41.47 5.26,41.47 RIGHT_SH.3
RESET  (via drill 0.5)
  Top 0.305: 43.01,34.01 R1.2 | R1.2 44.1,32.96 v44.1,32.9 | U$1.13 40.5,30.7 40.5,31.4 43.01,33.91 R1.2
  Bottom 0.305: ICSP.5 44.1,40.31 v44.1,32.9
RIGHT  (via drill 0.5)
  Top 0.305: U$1.1 50.39,25.6 v51.2,25.6
  Bottom 0.305: v51.2,25.6 53.02,27.42 53.72,27.42
SCK
  Top 0.305: U$1.9 46.3,30.56 46.3,35 41.43,39.87 ICSP.3
SELECT  (via drill 0.5)
  Top 0.305: U$1.28 36.64,17.5 v34.5,17.5
  Bottom 0.305: SELECT.1 41.2,6.26 41.2,7.17 40.93,8.2 38.14,9.82 36.02,9.28 36.34,9.6 36.34,12.02 34.5,13.86 v34.5,17.5
START  (via drill 0.5)
  Top 0.305: U$1.29 37.1,16.83 v37.1,15
  Bottom 0.305: v37.1,15 48.2,15 51.48,11.72 51.48,9.89 51.23,9.64 51.23,9.26 53.39,9.87 56.19,8.25 56.45,7.25 START.1
UP  (via drill 0.5)
  Top 0.305: U$1.12 42.43,31.5 v43,31.5
  Bottom 0.305: v43,31.5 48.7,31.5 53.2,36 62.54,36 63.46,36.92
VCC  (via drill 0.5)
  Top 0.305: 50.84,27.17 C2.1 51.53,27.17 | U$2.20 62.89,34.44 C10.1 62.64,33.5 | PAM8403.6 18.55,37.25 18.55,37.06 | PAM8403.4 20.32,35.45 | PAM8403.13 15.82,31.03 | 45.38,15.64 C3.1 | 22.32,37.28 C24.1 | 44.06,16.84 U$1.34 | 53.31,25.4 L1.1 | 40,33.61 C1.1 40.23,33.82 | R1.1
  Top 0.61: 50.84,27.17 U$1.2 49.27,25.57 48.3,24.6 | 15.82,31.03 C23.1 | 18.55,37.06 PAM8403.5 | PAM8403.5 PAM8403.4 20.5,35.79 20.5,35.8 22.05,37.35 C24.1 | PAM8403.13 PAM8403.12 PAM8403.5 | PAM8403.9 13.53,36 17.12,36 PAM8403.6 20.25,39.13 C25.1 | 45.38,15.64 U$1.34 43.5,17.52 43.5,18.2 48.3,23 48.3,24.6 | v61.5,33.5 62.64,33.5 | 22.32,37.28 22.9,36.7 34.1,36.7 35.1,37.7 | 51.53,27.17 53.31,25.4 | 48.3,24.6 48.2,24.6 45.8,27 45.8,27.8 | L1.1 v59.8,31.8 61.5,30.1 61.5,28.11 F1.1 62.76,26.71 C28.1 C27.1 58.4,22.34 58.4,20.7 59.5,19.6 v59.5,11.4 | 45.8,27.8 45,27.8 44.1,28.7 41.37,28.7 U$1.14 39.8,30.27 39.8,31.7 40.7,32.6 40.7,33.54 C1.1 R1.1 | 45.8,27.8 U$1.7 | R1.1 39.36,37.7 35.1,37.7 | ICSP.2 35.98,42.98 35.1,42.1 35.1,37.7
  Bottom 0.61: v59.8,31.8 v61.5,33.5 | ICSP.2 41.11,45.28 43.11,47.27 USB_HUB.8 | v59.5,11.4 59.5,6.06 ANALOG.2
VCC_POWER
  Top 0.813: POWER.1 65.96,15.26 | 65.96,15.26 66.17,15.47 USB_PI.4 | F1.2 65.96,23.65 65.96,15.26
VCCA  (via drill 0.5)
  Top 0.305: 51.24,21.1 C6.1 50.94,21.4 | 35.04,20.43 C7.1 | 49.84,22.56 U$1.44
  Top 0.61: U$1.44 50.94,21.4 | v46.7,23.8 38.41,23.8 U$1.24 35.44,20.83 C7.1 | C6.1 51.53,21.43 52.6,22.5 52.6,23.66 L1.2 51.81,23.8 v50.5,23.8
  Bottom 0.61: v46.7,23.8 v50.5,23.8
X  (via drill 0.5)
  Top 0.305: U$1.19 36.82,27.6 v35.9,27.6
  Bottom 0.305: 18.18,48.42 18.18,48.22 28.4,38 31.5,38 35.9,33.6 v35.9,27.6
Y  (via drill 0.5)
  Top 0.305: U$1.18 39.05,26.5 40.7,26.5 v41.1,26.9
  Bottom 0.305: 32.8,41.92 32.98,41.92 38.8,36.1 38.8,29.2 v41.1,26.9

### Text on the board
tNames: VCC | MOSI | GND | MISO | SCK | RESET
tStop: DMG Zero v0.3 / jctots 2016